# EAGLE design xen_daisy_motherboard_8cv8pt_mki (EAGLE 9.6.0)
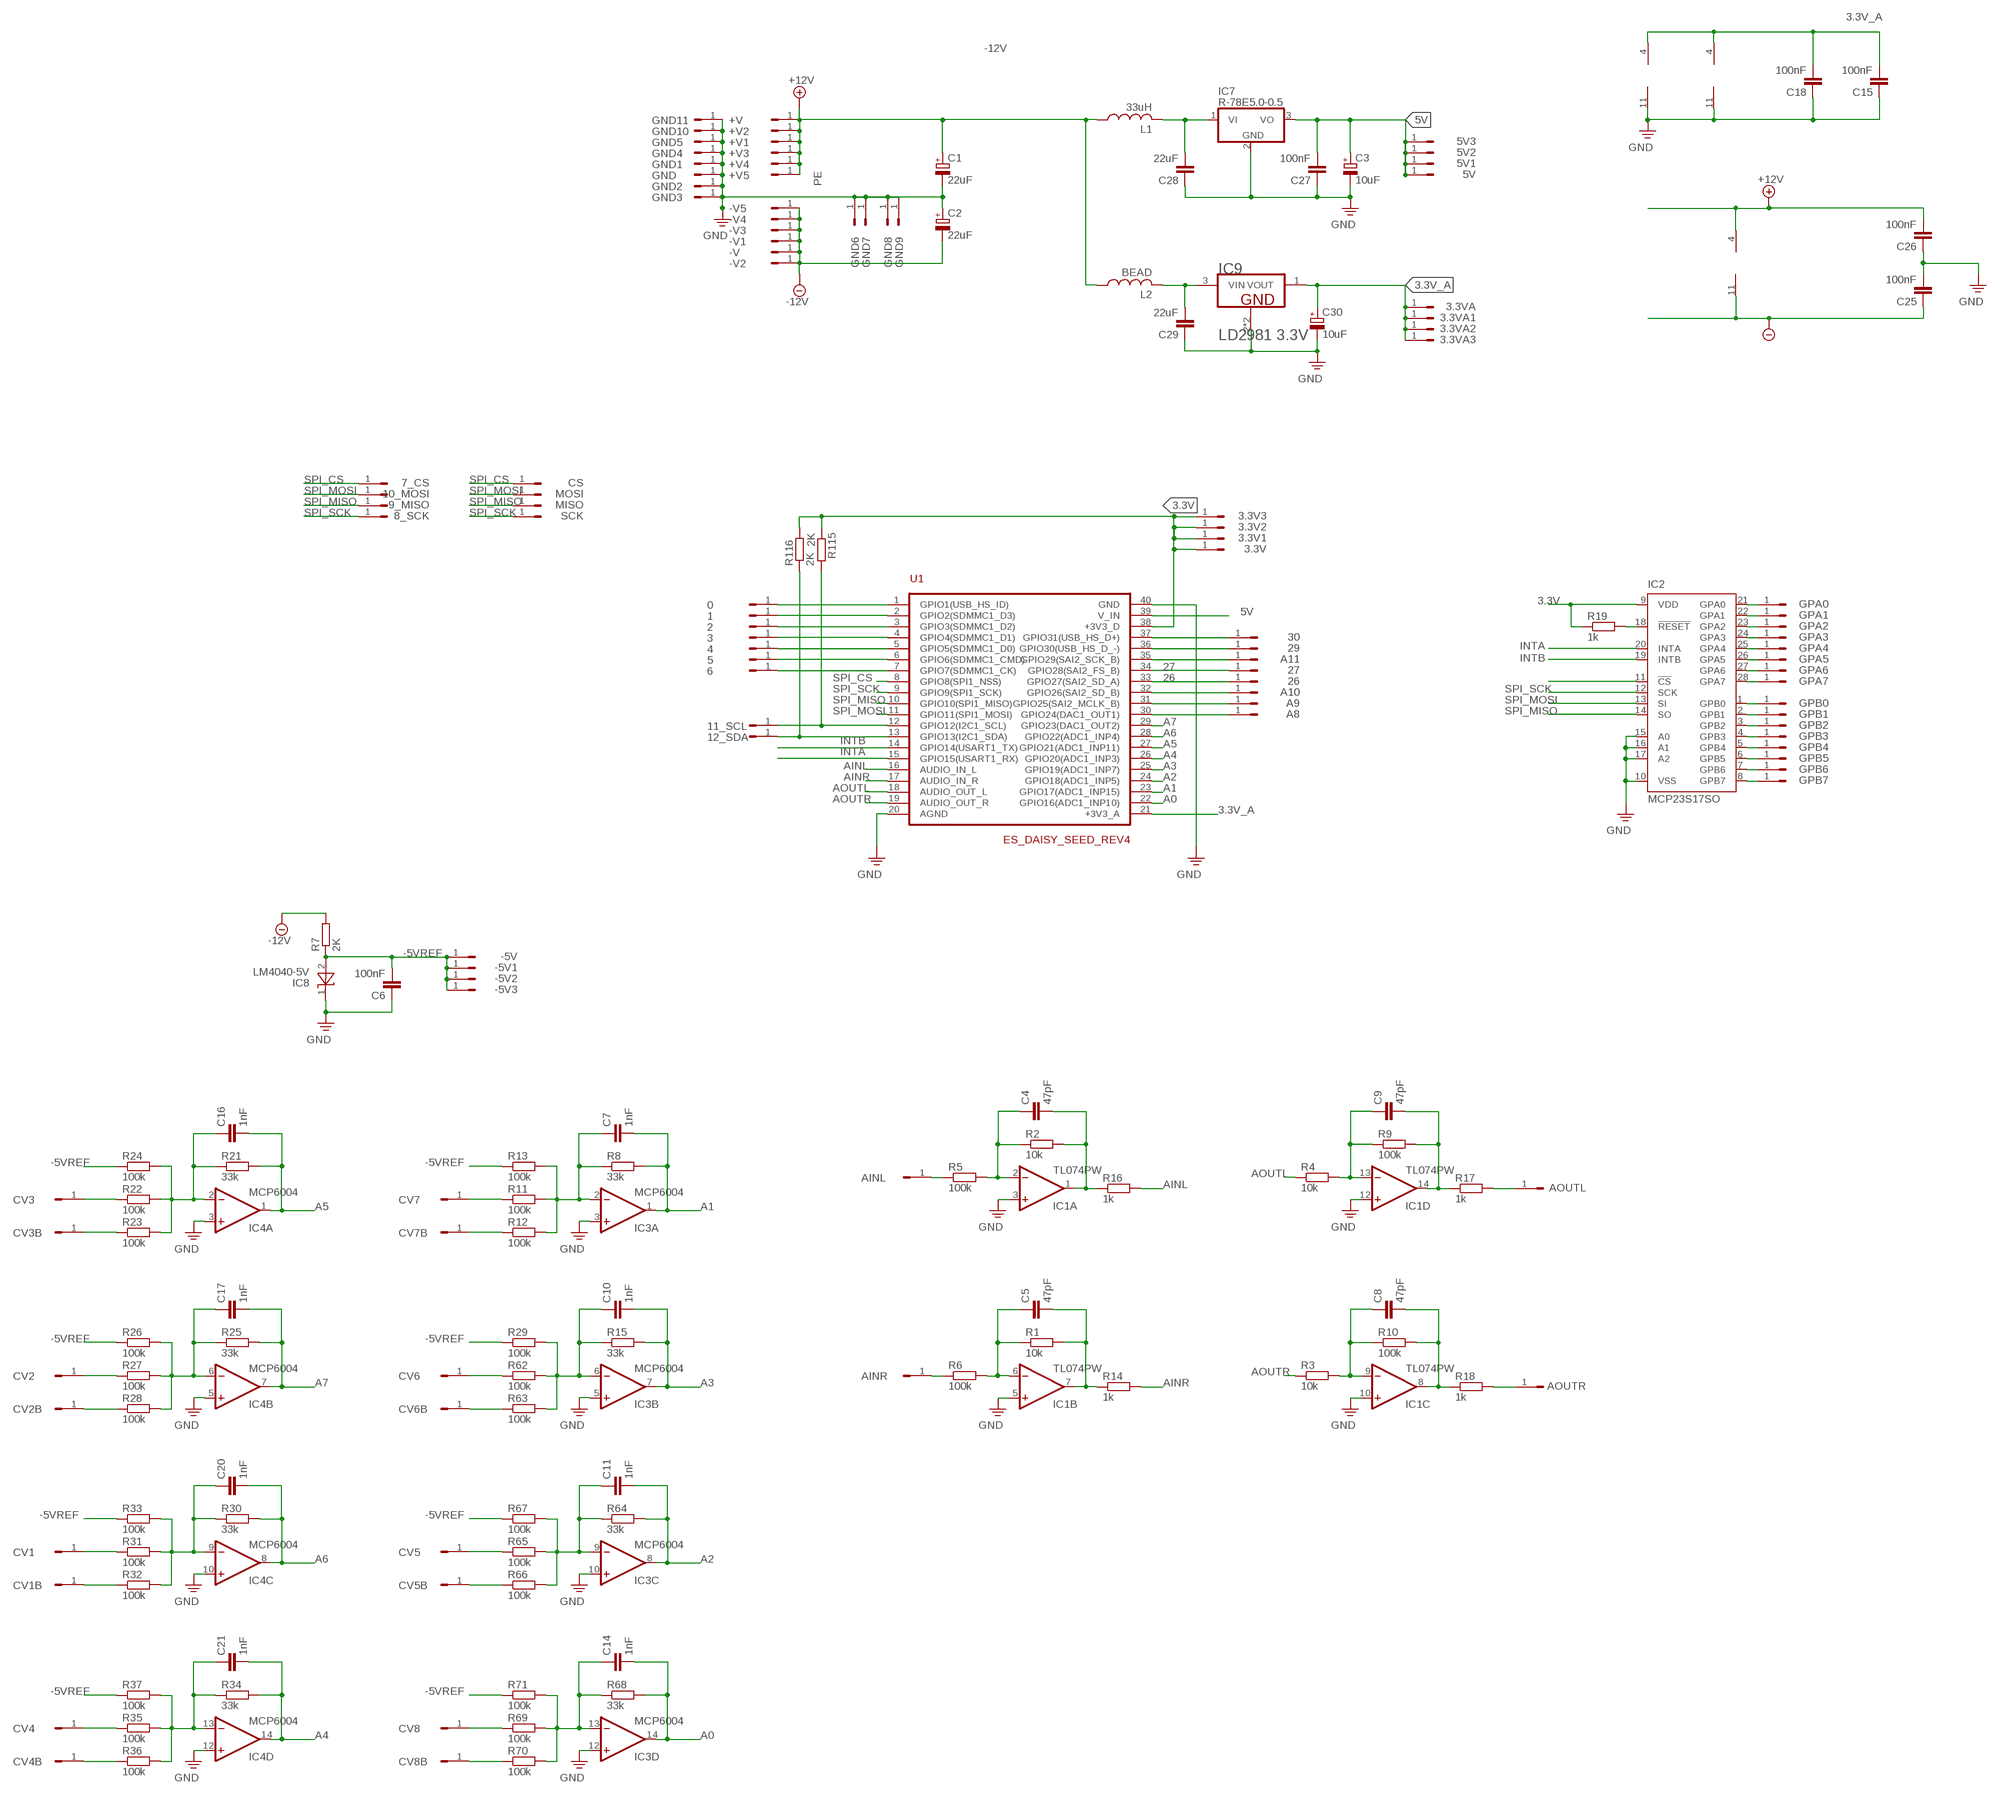
[diagram p0: schematic, sheet 1]

## Parts
0  HEADER/MALE/01  [HEADER/MALE/01]
1  HEADER/MALE/01  [HEADER/MALE/01]
2  HEADER/MALE/01  [HEADER/MALE/01]
3  HEADER/MALE/01  [HEADER/MALE/01]
3.3V  HEADER/MALE/01  [HEADER/MALE/01]
3.3V1  HEADER/MALE/01  [HEADER/MALE/01]
3.3V2  HEADER/MALE/01  [HEADER/MALE/01]
3.3V3  HEADER/MALE/01  [HEADER/MALE/01]
3.3VA  HEADER/MALE/01  [HEADER/MALE/01]
3.3VA1  HEADER/MALE/01  [HEADER/MALE/01]
3.3VA2  HEADER/MALE/01  [HEADER/MALE/01]
3.3VA3  HEADER/MALE/01  [HEADER/MALE/01]
4  HEADER/MALE/01  [HEADER/MALE/01]
5  HEADER/MALE/01  [HEADER/MALE/01]
5V  HEADER/MALE/01  [HEADER/MALE/01]
5V1  HEADER/MALE/01  [HEADER/MALE/01]
5V2  HEADER/MALE/01  [HEADER/MALE/01]
5V3  HEADER/MALE/01  [HEADER/MALE/01]
6  HEADER/MALE/01  [HEADER/MALE/01]
7_CS  HEADER/MALE/01  [HEADER/MALE/01]
8_SCK  HEADER/MALE/01  [HEADER/MALE/01]
9_MISO  HEADER/MALE/01  [HEADER/MALE/01]
10_MOSI  HEADER/MALE/01  [HEADER/MALE/01]
11_SCL  HEADER/MALE/01  [HEADER/MALE/01]
12_SDA  HEADER/MALE/01  [HEADER/MALE/01]
26  HEADER/MALE/01  [HEADER/MALE/01]
27  HEADER/MALE/01  [HEADER/MALE/01]
29  HEADER/MALE/01  [HEADER/MALE/01]
30  HEADER/MALE/01  [HEADER/MALE/01]
+V  HEADER/MALE/01  [HEADER/MALE/01]
+V1  HEADER/MALE/01  [HEADER/MALE/01]
+V2  HEADER/MALE/01  [HEADER/MALE/01]
+V3  HEADER/MALE/01  [HEADER/MALE/01]
+V4  HEADER/MALE/01  [HEADER/MALE/01]
+V5  HEADER/MALE/01  [HEADER/MALE/01]
-5V  HEADER/MALE/01  [HEADER/MALE/01]
-5V1  HEADER/MALE/01  [HEADER/MALE/01]
-5V2  HEADER/MALE/01  [HEADER/MALE/01]
-5V3  HEADER/MALE/01  [HEADER/MALE/01]
-V  HEADER/MALE/01  [HEADER/MALE/01]
-V1  HEADER/MALE/01  [HEADER/MALE/01]
-V2  HEADER/MALE/01  [HEADER/MALE/01]
-V3  HEADER/MALE/01  [HEADER/MALE/01]
-V4  HEADER/MALE/01  [HEADER/MALE/01]
-V5  HEADER/MALE/01  [HEADER/MALE/01]
A8  HEADER/MALE/01  [HEADER/MALE/01]
A9  HEADER/MALE/01  [HEADER/MALE/01]
A10  HEADER/MALE/01  [HEADER/MALE/01]
A11  HEADER/MALE/01  [HEADER/MALE/01]
AINL  HEADER/MALE/01  [HEADER/MALE/01]
AINR  HEADER/MALE/01  [HEADER/MALE/01]
AOUTL  HEADER/MALE/01  [HEADER/MALE/01]
AOUTR  HEADER/MALE/01  [HEADER/MALE/01]
C1  22uF  CAPACITOR/POLARIZEDSMDC  [SV-C]
C2  22uF  CAPACITOR/POLARIZEDSMDC  [SV-C]
C3  10uF  CAPACITOR/POLARIZEDSMDB  [SV-B]
C4  47pF  CAPACITORC0603  [C0603]
C5  47pF  CAPACITORC0603  [C0603]
C6  100nF  CAPACITORC0603  [C0603]
C7  1nF  CAPACITORC0603  [C0603]
C8  47pF  CAPACITORC0603  [C0603]
C9  47pF  CAPACITORC0603  [C0603]
C10  1nF  CAPACITORC0603  [C0603]
C11  1nF  CAPACITORC0603  [C0603]
C14  1nF  CAPACITORC0603  [C0603]
C15  100nF  CAPACITORC0603  [C0603]
C16  1nF  CAPACITORC0603  [C0603]
C17  1nF  CAPACITORC0603  [C0603]
C18  100nF  CAPACITORC0603  [C0603]
C20  1nF  CAPACITORC0603  [C0603]
C21  1nF  CAPACITORC0603  [C0603]
C25  100nF  CAPACITORC0603  [C0603]
C26  100nF  CAPACITORC0603  [C0603]
C27  100nF  CAPACITORC0603  [C0603]
C28  22uF  CAPACITORC0805  [C0805]
C29  22uF  CAPACITORC0805  [C0805]
C30  10uF  CAPACITOR/POLARIZEDSMDB  [SV-B]
CS  HEADER/MALE/01  [HEADER/MALE/01]
CV1  HEADER/MALE/01  [HEADER/MALE/01]
CV1B  HEADER/MALE/01  [HEADER/MALE/01]
CV2  HEADER/MALE/01  [HEADER/MALE/01]
CV2B  HEADER/MALE/01  [HEADER/MALE/01]
CV3  HEADER/MALE/01  [HEADER/MALE/01]
CV3B  HEADER/MALE/01  [HEADER/MALE/01]
CV4  HEADER/MALE/01  [HEADER/MALE/01]
CV4B  HEADER/MALE/01  [HEADER/MALE/01]
CV5  HEADER/MALE/01  [HEADER/MALE/01]
CV5B  HEADER/MALE/01  [HEADER/MALE/01]
CV6  HEADER/MALE/01  [HEADER/MALE/01]
CV6B  HEADER/MALE/01  [HEADER/MALE/01]
CV7  HEADER/MALE/01  [HEADER/MALE/01]
CV7B  HEADER/MALE/01  [HEADER/MALE/01]
CV8  HEADER/MALE/01  [HEADER/MALE/01]
CV8B  HEADER/MALE/01  [HEADER/MALE/01]
GND  HEADER/MALE/01  [HEADER/MALE/01]
GND1  HEADER/MALE/01  [HEADER/MALE/01]
GND2  HEADER/MALE/01  [HEADER/MALE/01]
GND3  HEADER/MALE/01  [HEADER/MALE/01]
GND4  HEADER/MALE/01  [HEADER/MALE/01]
GND5  HEADER/MALE/01  [HEADER/MALE/01]
GND6  HEADER/MALE/01  [HEADER/MALE/01]
GND7  HEADER/MALE/01  [HEADER/MALE/01]
GND8  HEADER/MALE/01  [HEADER/MALE/01]
GND9  HEADER/MALE/01  [HEADER/MALE/01]
GND10  HEADER/MALE/01  [HEADER/MALE/01]
GND11  HEADER/MALE/01  [HEADER/MALE/01]
GPA0  HEADER/MALE/01  [HEADER/MALE/01]
GPA1  HEADER/MALE/01  [HEADER/MALE/01]
GPA2  HEADER/MALE/01  [HEADER/MALE/01]
GPA3  HEADER/MALE/01  [HEADER/MALE/01]
GPA4  HEADER/MALE/01  [HEADER/MALE/01]
GPA5  HEADER/MALE/01  [HEADER/MALE/01]
GPA6  HEADER/MALE/01  [HEADER/MALE/01]
GPA7  HEADER/MALE/01  [HEADER/MALE/01]
GPB0  HEADER/MALE/01  [HEADER/MALE/01]
GPB1  HEADER/MALE/01  [HEADER/MALE/01]
GPB2  HEADER/MALE/01  [HEADER/MALE/01]
GPB3  HEADER/MALE/01  [HEADER/MALE/01]
GPB4  HEADER/MALE/01  [HEADER/MALE/01]
GPB5  HEADER/MALE/01  [HEADER/MALE/01]
GPB6  HEADER/MALE/01  [HEADER/MALE/01]
GPB7  HEADER/MALE/01  [HEADER/MALE/01]
IC1  TL074PW  [TSSOP14]
IC2  MCP23S17SO  [SO28W]
IC3  MCP6004  TL074PW  [TSSOP14]
IC4  MCP6004  TL074PW  [TSSOP14]
IC7  R-78E5.0-0.5  WE173950378  [WE78]
IC8  LM4040-5V  LM4040CYM3-2.5  [SOT-23]
IC9  LD2981 3.3V  LD2981LD2981-SOT89  [LD2981-SOT89]
L1  33uH  INDUCTORL2012C  [L2012C]
L2  BEAD  INDUCTORL0603  [R0603]
MISO  HEADER/MALE/01  [HEADER/MALE/01]
MOSI  HEADER/MALE/01  [HEADER/MALE/01]
R1  10k  RESISTOR  [R0603]
R2  10k  RESISTOR  [R0603]
R3  10k  RESISTOR  [R0603]
R4  10k  RESISTOR  [R0603]
R5  100k  RESISTOR  [R0603]
R6  100k  RESISTOR  [R0603]
R7  2K  RESISTOR  [R0603]
R8  33k  RESISTOR  [R0603]
R9  100k  RESISTOR  [R0603]
R10  100k  RESISTOR  [R0603]
R11  100k  RESISTOR  [R0603]
R12  100k  RESISTOR  [R0603]
R13  100k  RESISTOR  [R0603]
R14  1k  RESISTOR  [R0603]
R15  33k  RESISTOR  [R0603]
R16  1k  RESISTOR  [R0603]
R17  1k  RESISTOR  [R0603]
R18  1k  RESISTOR  [R0603]
R19  1k  RESISTOR  [R0603]
R21  33k  RESISTOR  [R0603]
R22  100k  RESISTOR  [R0603]
R23  100k  RESISTOR  [R0603]
R24  100k  RESISTOR  [R0603]
R25  33k  RESISTOR  [R0603]
R26  100k  RESISTOR  [R0603]
R27  100k  RESISTOR  [R0603]
R28  100k  RESISTOR  [R0603]
R29  100k  RESISTOR  [R0603]
R30  33k  RESISTOR  [R0603]
R31  100k  RESISTOR  [R0603]
R32  100k  RESISTOR  [R0603]
R33  100k  RESISTOR  [R0603]
R34  33k  RESISTOR  [R0603]
R35  100k  RESISTOR  [R0603]
R36  100k  RESISTOR  [R0603]
R37  100k  RESISTOR  [R0603]
R62  100k  RESISTOR  [R0603]
R63  100k  RESISTOR  [R0603]
R64  33k  RESISTOR  [R0603]
R65  100k  RESISTOR  [R0603]
R66  100k  RESISTOR  [R0603]
R67  100k  RESISTOR  [R0603]
R68  33k  RESISTOR  [R0603]
R69  100k  RESISTOR  [R0603]
R70  100k  RESISTOR  [R0603]
R71  100k  RESISTOR  [R0603]
R115  2K  RESISTOR  [R0603]
R116  2K  RESISTOR  [R0603]
SCK  HEADER/MALE/01  [HEADER/MALE/01]
U1  ES_DAISY_SEED_REV4  [ES_DAISY_SEED]

## Nets
3.3V: 3.3V1.1 3.3V2.1 3.3V3.1 3.3V.1 IC2.9(VDD) R19.1 R115.1 R116.2 U1.38(+3V3_D)
3.3V_A: 3.3VA1.1 3.3VA2.1 3.3VA3.1 3.3VA.1 C15.2 C18.2 C30.+ IC3.4(P:V+) IC4.4(P:V+) IC9.1(VOUT) U1.21(+3V3_A)
5V: 5V1.1 5V2.1 5V3.1 5V.1 C3.+ C27.2 IC7.3(VO) U1.39(V_IN)
26: 26.1 U1.33(GPIO27(SAI2_SD_A))
27: 27.1 U1.34(GPIO28(SAI2_FS_B))
+12V: +V1.1 +V2.1 +V3.1 +V4.1 +V5.1 +V.1 C1.+ C26.2 IC1.4(P:V+) L1.1 L2.1
-5VREF: -5V1.1 -5V2.1 -5V3.1 -5V.1 C6.2 IC8.2(A) R7.1 R13.1 R24.1 R26.1 R29.1 R33.1 R37.1 R67.1 R71.1
-12V: -V1.1 -V2.1 -V3.1 -V4.1 -V5.1 -V.1 C2.- C25.1 IC1.11(P:V-) R7.2
A0: C14.2 IC3.14(D:OUT) R68.2 U1.22(GPIO16(ADC1_INP10))
A1: C7.2 IC3.1(A:OUT) R8.2 U1.23(GPIO17(ADC1_INP15))
A2: C11.2 IC3.8(C:OUT) R64.2 U1.24(GPIO18(ADC1_INP5))
A3: C10.2 IC3.7(B:OUT) R15.2 U1.25(GPIO19(ADC1_INP7))
A4: C21.2 IC4.14(D:OUT) R34.2 U1.26(GPIO20(ADC1_INP3))
A5: C16.2 IC4.1(A:OUT) R21.2 U1.27(GPIO21(ADC1_INP11))
A6: C20.2 IC4.8(C:OUT) R30.2 U1.28(GPIO22(ADC1_INP4))
A7: C17.2 IC4.7(B:OUT) R25.2 U1.29(GPIO23(DAC1_OUT2))
AINL: R16.2 U1.16(AUDIO_IN_L)
AINR: R14.2 U1.17(AUDIO_IN_R)
AOUTL: R4.1 U1.18(AUDIO_OUT_L)
AOUTR: R3.1 U1.19(AUDIO_OUT_R)
INTA: IC2.20(INTA) U1.15(GPIO15(USART1_RX))
INTB: IC2.19(INTB) U1.14(GPIO14(USART1_TX))
N$1: CV2.1 R27.1
N$2: A8.1 U1.30(GPIO24(DAC1_OUT1))
N$3: A9.1 U1.31(GPIO25(SAI2_MCLK_B))
N$4: A10.1 U1.32(GPIO26(SAI2_SD_B))
N$5: A11.1 U1.35(GPIO29(SAI2_SCK_B))
N$6: C5.1 IC1.6(B:-IN) R1.1 R6.2
N$7: C4.1 IC1.2(A:-IN) R2.1 R5.2
N$8: C7.1 IC3.2(A:-IN) R8.1 R11.2 R12.2 R13.2
N$9: C4.2 IC1.1(A:OUT) R2.2 R16.1
N$10: C5.2 IC1.7(B:OUT) R1.2 R14.1
N$11: AOUTL.1 R17.2
N$12: AOUTR.1 R18.2
N$13: CV7B.1 R12.1
N$14: CV7.1 R11.1
N$15: C9.1 IC1.13(D:-IN) R4.2 R9.1
N$16: C10.1 IC3.6(B:-IN) R15.1 R29.2 R62.2 R63.2
N$17: C8.1 IC1.9(C:-IN) R3.2 R10.1
N$18: CV6.1 R62.1
N$19: CV6B.1 R63.1
N$20: AINL.1 R5.1
N$21: C8.2 IC1.8(C:OUT) R10.2 R18.1
N$22: CV3.1 R22.1
N$23: C9.2 IC1.14(D:OUT) R9.2 R17.1
N$24: C16.1 IC4.2(A:-IN) R21.1 R22.2 R23.2 R24.2
N$25: AINR.1 R6.1
N$26: CV2B.1 R28.1
N$27: CV3B.1 R23.1
N$28: 29.1 U1.36(GPIO30(USB_HS_D_-))
N$29: C17.1 IC4.6(B:-IN) R25.1 R26.2 R27.2 R28.2
N$30: C21.1 IC4.13(D:-IN) R34.1 R35.2 R36.2 R37.2
N$31: CV4.1 R35.1
N$32: CV4B.1 R36.1
N$33: 30.1 U1.37(GPIO31(USB_HS_D+))
N$34: CV1B.1 R32.1
N$35: CV1.1 R31.1
N$36: C20.1 IC4.9(C:-IN) R30.1 R31.2 R32.2 R33.2
N$37: 0.1 U1.1(GPIO1(USB_HS_ID))
N$38: 1.1 U1.2(GPIO2(SDMMC1_D3))
N$39: 2.1 U1.3(GPIO3(SDMMC1_D2))
N$40: 3.1 U1.4(GPIO4(SDMMC1_D1))
N$41: 11_SCL.1 R115.2 U1.12(GPIO12(I2C1_SCL))
N$42: 4.1 U1.5(GPIO5(SDMMC1_D0))
N$43: 5.1 U1.6(GPIO6(SDMMC1_CMD))
N$44: 6.1 U1.7(GPIO7(SDMMC1_CK))
N$48: IC2.18(!RESET) R19.2
N$50: IC2.11(!CS)
N$51: C28.2 IC7.1(VI) L1.2
N$52: 12_SDA.1 R116.1 U1.13(GPIO13(I2C1_SDA))
N$54: GPB7.1 IC2.8(GPB7)
N$55: GPB6.1 IC2.7(GPB6)
N$56: GPB5.1 IC2.6(GPB5)
N$57: C14.1 IC3.13(D:-IN) R68.1 R69.2 R70.2 R71.2
N$58: GPB4.1 IC2.5(GPB4)
N$59: GPB3.1 IC2.4(GPB3)
N$60: CV8.1 R69.1
N$61: GPB2.1 IC2.3(GPB2)
N$62: GPB1.1 IC2.2(GPB1)
N$63: GPB0.1 IC2.1(GPB0)
N$64: GPA7.1 IC2.28(GPA7)
N$65: GPA6.1 IC2.27(GPA6)
N$66: GPA5.1 IC2.26(GPA5)
N$67: GPA4.1 IC2.25(GPA4)
N$68: CV8B.1 R70.1
N$69: CV5B.1 R66.1
N$70: CV5.1 R65.1
N$71: C11.1 IC3.9(C:-IN) R64.1 R65.2 R66.2 R67.2
N$72: C29.2 IC9.3(VIN) L2.2
N$73: GPA3.1 IC2.24(GPA3)
N$74: GPA2.1 IC2.23(GPA2)
N$75: GPA1.1 IC2.22(GPA1)
N$76: GPA0.1 IC2.21(GPA0)
PE: C1.- C2.+ C3.- C6.1 C15.1 C18.1 C25.2 C26.1 C27.1 C28.1 C29.1 C30.- GND1.1 GND2.1 GND3.1 GND4.1 GND5.1 GND6.1 GND7.1 GND8.1 GND9.1 GND10.1 GND11.1 GND.1 IC1.3(A:+IN) IC1.5(B:+IN) IC1.10(C:+IN) IC1.12(D:+IN) IC2.10(VSS) IC2.15(A0) IC2.16(A1) IC2.17(A2) IC3.3(A:+IN) IC3.5(B:+IN) IC3.10(C:+IN) IC3.11(P:V-) IC3.12(D:+IN) IC4.3(A:+IN) IC4.5(B:+IN) IC4.10(C:+IN) IC4.11(P:V-) IC4.12(D:+IN) IC7.2(GND) IC8.1(C) IC9.2(GND) IC9.2-2(GND) U1.20(AGND) U1.40(GND) ; supply symbol labelled GND
SPI_CS: 7_CS.1 CS.1 U1.8(GPIO8(SPI1_NSS))
SPI_MISO: 9_MISO.1 IC2.14(SO) MISO.1 U1.10(GPIO10(SPI1_MISO))
SPI_MOSI: 10_MOSI.1 IC2.13(SI) MOSI.1 U1.11(GPIO11(SPI1_MOSI))
SPI_SCK: 8_SCK.1 IC2.12(SCK) SCK.1 U1.9(GPIO9(SPI1_SCK))

## Library data of the parts
0 1-3 3.3V 3.3V1-3.3V3 3.3VA 3.3VA1-3.3VA3 4 5 5V 5V1-5V3 6 7_CS 8_SCK 9_MISO 10_MOSI 11_SCL 12_SDA 26 27 29 30 +V +V1-+V5 -5V -5V1--5V3 -V -V1--V5 A8-A11 AINL AINR AOUTL AOUTR CS CV1 CV1B CV2 CV2B CV3 CV3B CV4 CV4B CV5 CV5B CV6 CV6B CV7 CV7B CV8 CV8B GND GND1-GND11 GPA0 GPA1-GPA7 GPB0 GPB1-GPB7 MISO MOSI SCK = connectors:HEADER/MALE/01; SPICEPREFIX: X
C1-C3 C30 = capacitors:CAPACITOR/POLARIZED: POLARIZED CAPACITOR, European symbol; SPICEPREFIX: C
C4-C11 C14 C16 C17 C20 C21 C27-C29 = capacitors:CAPACITOR: CAPACITOR, European symbol
C15 C18 C25 C26 = capacitors:CAPACITOR: CAPACITOR, European symbol; SPICEPREFIX: C
IC1 IC3 IC4 = ic_analogue:TL074: OP AMP; SPICEPREFIX: I
IC2 = ic_digital:MCP23S17: http://ww1.microchip.com/downloads/en/DeviceDoc/21952a.pdf Source: http://ww1.microchip.com/downloads/en/DeviceDoc/21952a.pdf; MF: MICROCHIP; MPN: MCP23S17-E/SO; OC_FARNELL: unknown; OC_NEWARK: 31K2950
IC7 = ic_voltage_reg:WE173950378
IC8 = ic_voltage_reg:LM4040
IC9 = ic_voltage_reg:LD2981: PM-REG-7805-SIL3; CIIVA_IDS: 1494330; COMPONENT_LINK_1_DESCRIPTION: Manufacturer URL; COMPONENT_LINK_1_URL: http://www.st.com; DATASHEET: http://www.st.com/internet/com/TECHNICAL_RESOURCES/TECHNICAL_LITERATURE/DATASHEET/CD00001635.pdf; DATASHEET_VERSION: 14/07/2008; FOOTPRINT_VARIANT_NAME_0: Level C; FOOTPRINT_VARIANT_NAME_1: Level B; FOOTPRINT_VARIANT_NAME_2: Level A; IMPORTED: yes; IMPORTED_FROM: vault; IMPORT_TS: 1521842653; MF: STMicroelectronics; MPN: LD2981CU33TR; PACKAGE: SOT-89; PACKAGE_DESCRIPTION: 3-Pin SOT-89 Package 1.5 mm Pitch, 4.1 mm Lead Span; PACKAGE_VERSION: 2011; PREFIX: U; RELEASE_DATE: 1329864115; VAULT_GUID: D31A5547-DC71-496C-B469-D3C4896B0EF1; VAULT_REVISION: 2FAEF0D7-B25B-4AA3-8C5F-6F8AF18FFD96
L1 L2 = resistors:INDUCTOR
R1-R19 R21-R37 R62-R71 R115 R116 = resistors:RESISTOR: RESISTOR, European symbol
U1 = microcontroller:ES_DAISY_SEED_REV4; IPN: Daisy Seed

## Board
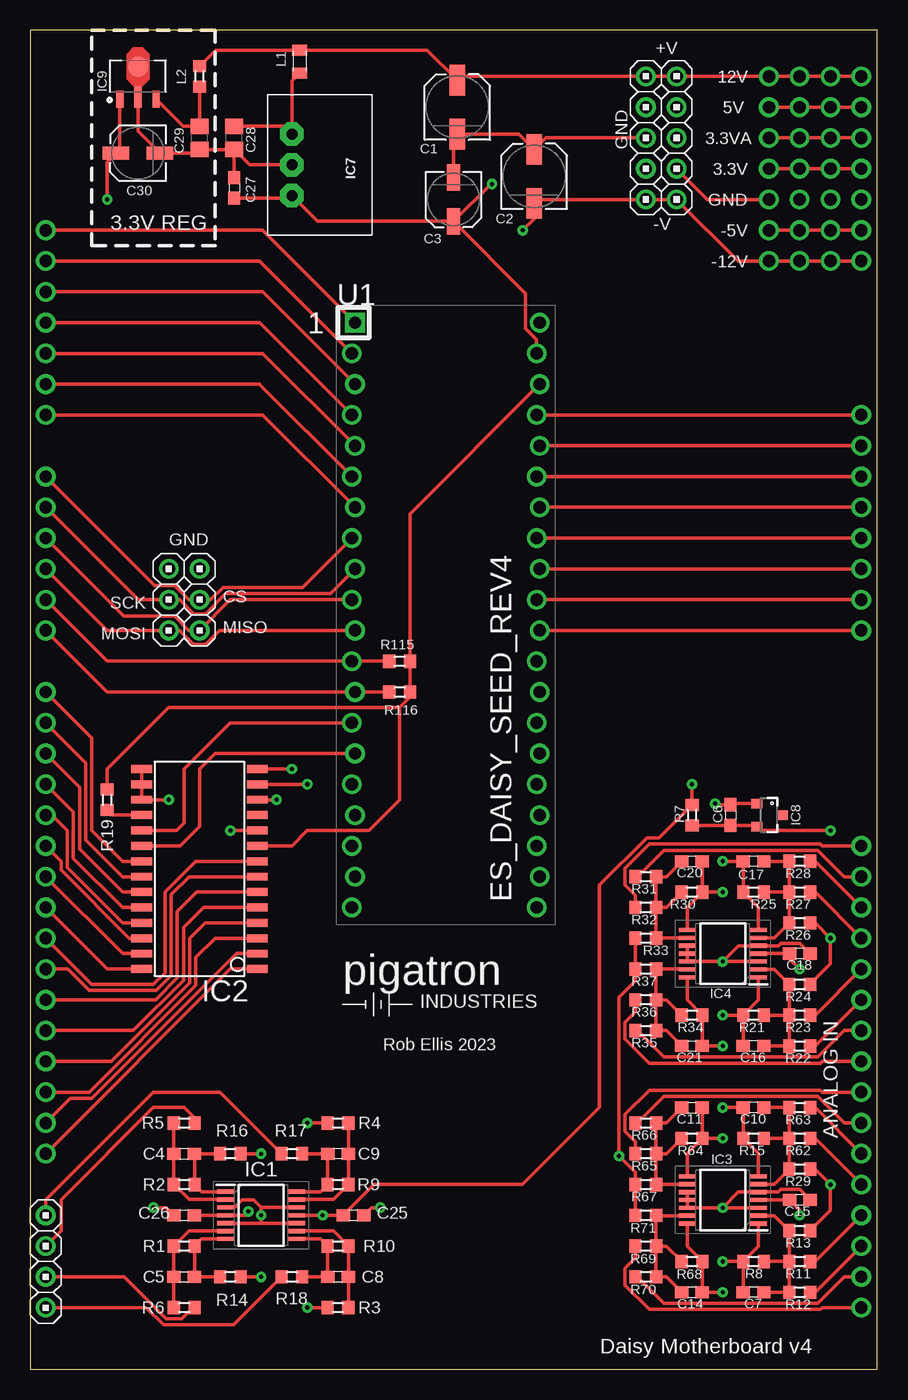
[diagram p1: board, top side]
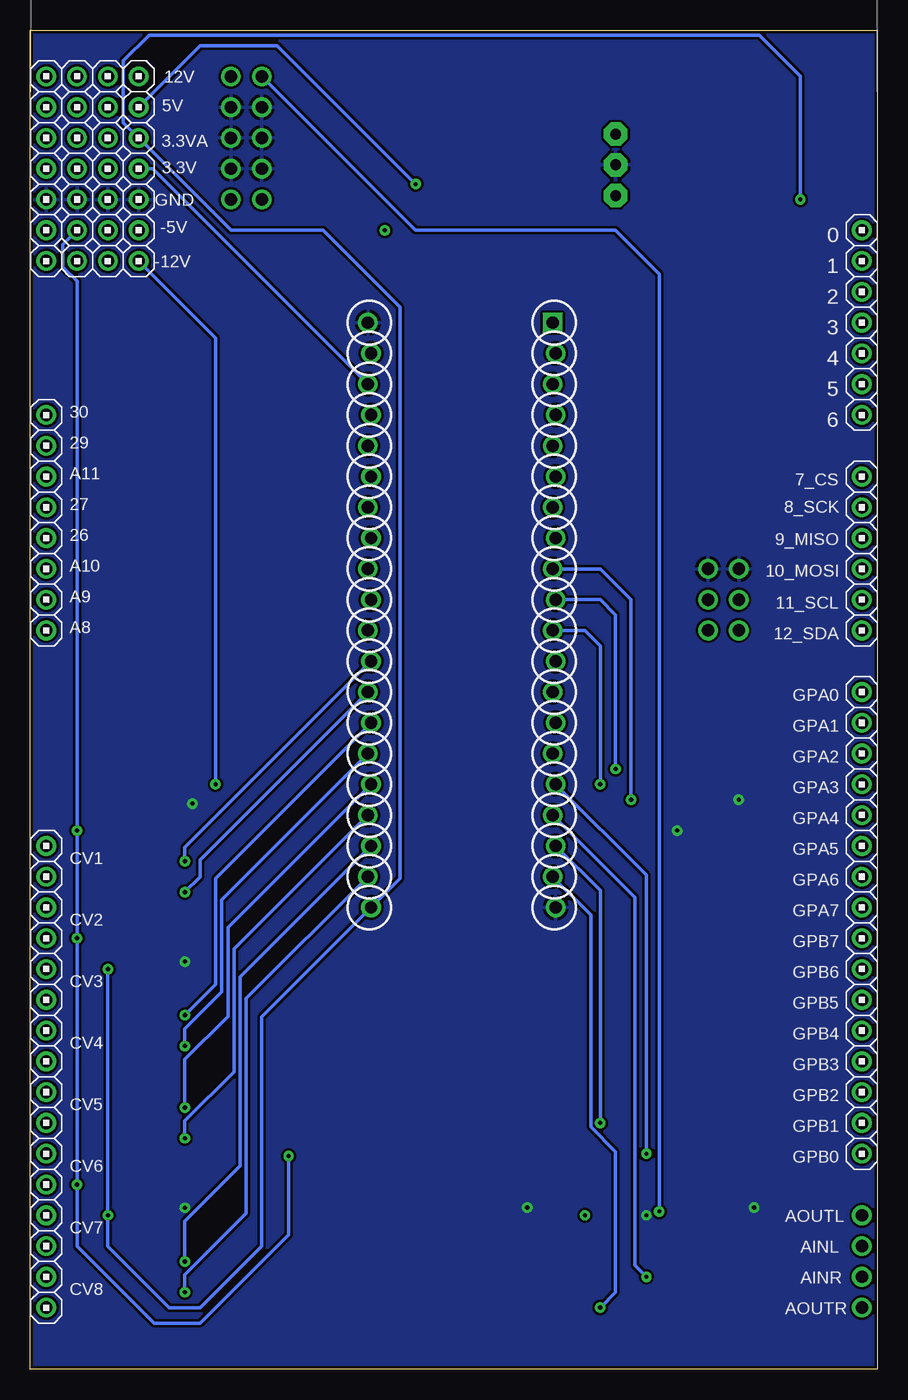
[diagram p2: board, bottom side, seen from below]

Size 69.9 x 110.48 mm. Coordinates in mm from the lower left corner, seen from the top.
Outline: 0,0 69.9,0 69.9,110.48 0,110.48 0,0
Copper layers (1*16): Top 0.0356mm / dielectric 1.5011mm / Bottom 0.0356mm
Design rules "pigatron *": minimum track width 8mil, minimum drill 13mil, track to track 8mil, track to pad 8mil, pad to pad 8mil, via to via 8mil, smd to smd 6mil, copper to edge 10mil, drill to drill 10mil, minimum pad ring 12mil, minimum via ring 10mil, stop-mask expansion 4mil, vias tented up to drill 15mil, thermal gap 10mil

### Footprints (pad centres in the part's own frame; a part is rotated, then mirrored left to right if it is on the bottom)
HEADER/MALE/01 = drill 1.016: 1 0,0
SV-C = smd 2.54 x 1.27: + -2.223,0; - 2.223,0
SV-B = smd 2.184 x 1.067: + -1.81,0; - 1.81,0
C0603 = smd 1.1 x 1: 1 -0.85,0; 2 0.85,0
C0805 = smd 1.3 x 1.5: 1 -0.95,0; 2 0.95,0
TSSOP14 = smd 0.35 x 1.4: 1 -1.95,-2.938; 2 -1.3,-2.938; 3 -0.65,-2.938; 4 0,-2.938; 5 0.65,-2.938; 6 1.3,-2.938; 7 1.95,-2.938; 8 1.95,2.938; 9 1.3,2.938; 10 0.65,2.938; 11 0,2.938; 12 -0.65,2.938; 13 -1.3,2.938; 14 -1.95,2.938
SO28W = smd 0.65 x 1.7: 1 -7.62,-4.78; 2 -6.35,-4.78; 3 -5.08,-4.78; 4 -3.81,-4.78; 5 -2.54,-4.78; 6 -1.27,-4.78; 7 0,-4.78; 8 1.27,-4.78; 9 2.54,-4.78; 10 3.81,-4.78; 11 5.08,-4.78; 12 6.35,-4.78; 13 7.62,-4.78; 14 8.89,-4.78; 15 8.89,4.78; 16 7.62,4.78; 17 6.35,4.78; 18 5.08,4.78; 19 3.81,4.78; 20 2.54,4.78; 21 1.27,4.78; 22 0,4.78; 23 -1.27,4.78; 24 -2.54,4.78; 25 -3.81,4.78; 26 -5.08,4.78; 27 -6.35,4.78; 28 -7.62,4.78
WE78 = drill 0.9 pad 1.93 octagon: 1 -2.54,0; 2 0,0; 3 2.54,0
SOT-23 = smd 0.8 x 0.9: 1 -0.95,-1; 2 0.95,-1; 3 0,1.1
LD2981-SOT89 = smd 1.4 x 0.6: 1 -1.9,1.5; 3 -1.9,-1.5 | smd 1.8 x 0.6: 2 -1.7,0 | smd 1.71 x 1.71: 2-2 0.8,0
L2012C = smd 0.9 x 1.25: 1 -0.9,0; 2 1,0
R0603 = smd 1 x 1.1: 1 -0.85,0; 2 0.85,0
ES_DAISY_SEED = drill 1.016 square: 1 -7.493,24.13 | drill 1.016: 2 -7.747,21.59; 3 -7.493,19.05; 4 -7.747,16.51; 5 -7.493,13.97; 6 -7.747,11.43; 7 -7.493,8.89; 8 -7.747,6.35; 9 -7.493,3.81; 10 -7.747,1.27; 11 -7.493,-1.27; 12 -7.747,-3.81; 13 -7.493,-6.35; 14 -7.747,-8.89; 15 -7.493,-11.43; 16 -7.747,-13.97; 17 -7.493,-16.51; 18 -7.747,-19.05; 19 -7.493,-21.59; 20 -7.747,-24.13; 21 7.493,-24.13; 22 7.747,-21.59; 23 7.493,-19.05; 24 7.747,-16.51; 25 7.493,-13.97; 26 7.747,-11.43; 27 7.493,-8.89; 28 7.747,-6.35; 29 7.493,-3.81; 30 7.747,-1.27; 31 7.493,1.27; 32 7.747,3.81; 33 7.493,6.35; 34 7.747,8.89; 35 7.493,11.43; 36 7.747,13.97; 37 7.493,16.51; 38 7.747,19.05; 39 7.493,21.59; 40 7.747,24.13

### Placement (x,y rotation side)
0  1.27,93.98 180 bottom
1  1.27,91.44 180 bottom
2  1.27,88.9 180 bottom
3  1.27,86.36 180 bottom
3.3V  60.96,99.06 90 bottom
3.3V1  63.5,99.06 180 bottom
3.3V2  66.04,99.06 0 bottom
3.3V3  68.58,99.06 0 bottom
3.3VA  60.96,101.6 180 bottom
3.3VA1  63.5,101.6 0 bottom
3.3VA2  66.04,101.6 0 bottom
3.3VA3  68.58,101.6 0 bottom
4  1.27,83.82 180 bottom
5  1.27,81.28 180 bottom
5V  60.96,104.14 180 bottom
5V1  63.5,104.14 180 bottom
5V2  66.04,104.14 0 bottom
5V3  68.58,104.14 0 bottom
6  1.27,78.74 180 bottom
7_CS  1.27,73.66 180 bottom
8_SCK  1.27,71.12 180 bottom
9_MISO  1.27,68.58 180 bottom
10_MOSI  1.27,66.04 180 bottom
11_SCL  1.27,63.5 180 bottom
12_SDA  1.27,60.96 180 bottom
26  68.58,68.58 0 bottom
27  68.58,71.12 0 bottom
29  68.58,76.2 0 bottom
30  68.58,78.74 0 bottom
+V  53.34,106.68 0 top
+V1  63.5,106.68 0 bottom
+V2  50.8,106.68 180 top
+V3  60.96,106.68 0 bottom
+V4  66.04,106.68 0 bottom
+V5  68.58,106.68 0 bottom
-5V  63.5,93.98 180 bottom
-5V1  60.96,93.98 180 bottom
-5V2  66.04,93.98 0 bottom
-5V3  68.58,93.98 0 bottom
-V  53.34,96.52 0 top
-V1  60.96,91.44 0 bottom
-V2  50.8,96.52 180 top
-V3  63.5,91.44 0 bottom
-V4  66.04,91.44 0 bottom
-V5  68.58,91.44 0 bottom
A8  68.58,60.96 0 bottom
A9  68.58,63.5 0 bottom
A10  68.58,66.04 0 bottom
A11  68.58,73.66 0 bottom
AINL  1.27,10.16 0 top
AINR  1.27,7.62 0 top
AOUTL  1.27,12.7 0 top
AOUTR  1.27,5.08 0 top
C1  35.24,104.14 270 top
C2  41.59,98.42 270 top
C3  34.92,96.52 90 top
C4  12.7,17.78 0 top
C5  12.7,7.62 0 top
C6  57.78,45.72 270 top
C7  59.69,6.35 180 top
C8  25.4,7.62 180 top
C9  25.4,17.78 180 top
C10  59.69,21.59 180 top
C11  54.61,21.59 0 top
C14  54.61,6.35 0 top
C15  63.5,13.97 180 top
C16  59.69,26.67 180 top
C17  59.69,41.91 180 top
C18  63.5,34.29 180 top
C20  54.61,41.91 0 top
C21  54.61,26.67 0 top
C25  26.67,12.7 0 top
C26  12.7,12.7 0 top
C27  16.83,97.47 270 top
C28  16.83,101.6 90 top
C29  13.97,101.6 90 top
C30  8.89,100.33 0 top
CS  13.97,63.5 0 top
CV1  68.58,40.64 180 bottom
CV1B  68.58,43.18 180 bottom
CV2  68.58,35.56 180 bottom
CV2B  68.58,38.1 180 bottom
CV3  68.58,30.48 180 bottom
CV3B  68.58,33.02 180 bottom
CV4  68.58,27.94 180 bottom
CV4B  68.58,25.4 180 bottom
CV5  68.58,22.86 0 bottom
CV5B  68.58,20.32 0 bottom
CV6  68.58,15.24 0 bottom
CV6B  68.58,17.78 0 bottom
CV7  68.58,12.7 0 bottom
CV7B  68.58,10.16 0 bottom
CV8  68.58,5.08 0 bottom
CV8B  68.58,7.62 0 bottom
GND  53.34,101.6 0 top
GND1  53.34,104.14 0 top
GND2  50.8,99.06 180 top
GND3  53.34,99.06 180 top
GND4  50.8,101.6 0 top
GND5  50.8,104.14 0 top
GND6  63.5,96.52 0 bottom
GND7  60.96,96.52 0 bottom
GND8  66.04,96.52 0 bottom
GND9  68.58,96.52 0 bottom
GND10  13.97,66.04 0 top
GND11  11.43,66.04 0 top
GPA0  1.27,55.88 180 bottom
GPA1  1.27,53.34 180 bottom
GPA2  1.27,50.8 180 bottom
GPA3  1.27,48.26 180 bottom
GPA4  1.27,45.72 180 bottom
GPA5  1.27,43.18 180 bottom
GPA6  1.27,40.64 180 bottom
GPA7  1.27,38.1 180 bottom
GPB0  1.27,17.78 180 bottom
GPB1  1.27,20.32 180 bottom
GPB2  1.27,22.86 180 bottom
GPB3  1.27,25.4 180 bottom
GPB4  1.27,27.94 180 bottom
GPB5  1.27,30.48 180 bottom
GPB6  1.27,33.02 180 bottom
GPB7  1.27,35.56 180 bottom
IC1  19.05,12.7 270 top
IC2  13.97,40.64 90 top
IC3  57.15,13.97 90 top
IC4  57.15,34.29 90 top
IC7  21.59,99.38 270 top
IC8  60.96,45.72 270 top
IC9  8.89,106.68 90 top
L1  22.23,107.95 270 top
L2  13.97,106.68 270 top
MISO  13.97,60.96 0 top
MOSI  11.43,60.96 180 top
R1  12.7,10.16 0 top
R2  12.7,15.24 0 top
R3  25.4,5.08 0 top
R4  25.4,20.32 0 top
R5  12.7,20.32 180 top
R6  12.7,5.08 180 top
R7  54.61,45.72 90 top
R8  59.69,8.89 180 top
R9  25.4,15.24 180 top
R10  25.4,10.16 180 top
R11  63.5,8.89 180 top
R12  63.5,6.35 180 top
R13  63.5,11.43 180 top
R14  16.51,7.62 0 top
R15  59.69,19.05 180 top
R16  16.51,17.78 0 top
R17  21.59,17.78 180 top
R18  21.59,7.62 180 top
R19  6.35,46.99 270 top
R21  59.69,29.21 180 top
R22  63.5,26.67 180 top
R23  63.5,29.21 180 top
R24  63.5,31.75 180 top
R25  59.69,39.37 180 top
R26  63.5,36.83 180 top
R27  63.5,39.37 180 top
R28  63.5,41.91 180 top
R29  63.5,16.51 180 top
R30  54.61,39.37 0 top
R31  50.8,40.64 0 top
R32  50.8,38.1 0 top
R33  50.8,35.56 0 top
R34  54.61,29.21 0 top
R35  50.8,27.94 0 top
R36  50.8,30.48 0 top
R37  50.8,33.02 0 top
R62  63.5,19.05 180 top
R63  63.5,21.59 180 top
R64  54.61,19.05 0 top
R65  50.8,17.78 0 top
R66  50.8,20.32 0 top
R67  50.8,15.24 0 top
R68  54.61,8.89 0 top
R69  50.8,10.16 0 top
R70  50.8,7.62 0 top
R71  50.8,12.7 0 top
R115  30.48,58.42 180 top
R116  30.48,55.88 0 top
SCK  11.43,63.5 180 top
U1  34.29,62.23 0 top
U$1  [PIGATRON-LOGO]  34.67,31.69 0 top

### Tracks (layer width: path | path; a pad name or v marks a point on that pad's centre or on a via)
3.3V
  Top 0.305: 3.3V.1 3.3V1.1 3.3V2.1 3.3V3.1 | U1.38 31.33,70.57 R115.1 R116.2 31.33,55.46 30.48,54.61 | R19.1 6.35,49.53 11.43,54.61 30.48,54.61 | IC2.9 21.59,43.18 22.86,44.45 27.94,44.45 30.48,46.99 30.48,54.61
  Bottom 0.305: U1.38 59.82,99.06 3.3V.1
3.3V_A  (via drill 0.35)
  Top 0.305: IC9.1 7.39,100.64 C30.+ 6.35,99.6 v6.35,96.52 | IC4.4 C18.2 62.65,33.87 v63.5,33.02 | IC3.4 C15.2 63.5,13.12 v63.5,12.7 | 3.3VA.1 3.3VA1.1 3.3VA2.1 3.3VA3.1
  Bottom 0.305: v6.35,96.52 6.35,106.68 9.74,110.07 60.11,110.07 62.23,107.95 62.23,102.87 3.3VA.1 53.34,93.98 45.72,93.98 39.37,87.63 39.37,40.51 U1.21 50.8,29.08 50.8,10.16 55.88,5.08 58.42,5.08 63.5,10.16 v63.5,12.7 v63.5,33.02
5V  (via drill 0.35)
  Top 0.305: C27.2 21.38,96.62 IC7.3 23.72,94.71 C3.+ | 5V3.1 5V2.1 5V1.1 5V.1 | C3.+ 38.01,97.79 v38.1,97.79 | U1.39 41.78,84.96 40.87,85.88 40.87,88.77 C3.+
  Bottom 0.305: v38.1,97.79 49.53,109.22 55.88,109.22 5V.1
26
  Top 0.305: U1.33 26.1
27
  Top 0.305: 27.1 U1.34
+12V  (via drill 0.35)
  Top 0.305: +V5.1 +V4.1 +V1.1 +V3.1 +V.1 +V2.1 35.56,106.68 C1.+ 32.76,108.85 L1.1 15.29,108.85 L2.1 | C26.2 IC1.4 17.78,12.7 17.99,12.91 v17.99,13.02
  Bottom 0.305: +V2.1 38.1,93.98 21.59,93.98 17.99,90.38 v17.99,13.02
-5VREF  (via drill 0.35)
  Top 0.305: R33.1 R37.1 49.95,32.03 48.59,30.67 v48.59,17.59 49.95,16.23 R67.1 R71.1 | R7.1 C6.2 59.86,44.87 IC8.2 60.28,44.45 v66.04,44.45 | -5V3.1 -5V2.1 -5V.1 -5V1.1 | R24.1 66.04,33.44 v66.04,35.56 64.77,36.83 R26.1 | R29.1 64.77,16.51 v66.04,15.24 66.04,13.12 R13.1
  Bottom 0.305: -5V2.1 67.21,92.81 67.21,90.96 66.04,89.79 v66.04,44.45 v66.04,35.56 v66.04,15.24 66.04,10.16 59.69,3.81 55.88,3.81 48.59,11.1 v48.59,17.59
-12V  (via drill 0.35)
  Top 0.305: -V5.1 -V4.1 -V3.1 -V1.1 58.42,91.44 -V.1 -V2.1 41.91,96.52 C2.- 41.59,94.93 v40.64,93.98 | IC1.11 v24.13,12.7 C25.1 28.36,15.24 40.64,15.24 46.99,21.59 46.99,39.95 50.87,43.83 51.87,43.83 R7.2 v54.61,48.26
  Bottom 0.305: v54.61,48.26 54.61,85.09 -V1.1
A0  (via drill 0.35)
  Top 0.305: IC3.14 54.21,10.14 R68.2 C14.2 v57.15,6.35
  Bottom 0.305: U1.22 52.07,30.61 52.07,12.86 57.15,7.78 v57.15,6.35
A1  (via drill 0.35)
  Top 0.305: R8.2 60.09,10.14 IC3.1 | C7.2 R8.2 | R8.2 v57.15,8.89
  Bottom 0.305: U1.23 52.58,32.38 52.58,16.78 57.15,12.21 v57.15,8.89
A2  (via drill 0.35)
  Top 0.305: C11.2 R64.2 | R64.2 54.21,17.8 IC3.8 | R64.2 v57.15,19.05
  Bottom 0.305: U1.24 53.09,34.67 53.09,24.54 57.15,20.48 v57.15,19.05
A3  (via drill 0.35)
  Top 0.305: IC3.7 60.09,17.8 R15.2 C10.2 v57.15,21.59
  Bottom 0.305: U1.25 53.59,36.45 53.59,29.12 57.15,25.56 v57.15,21.59
A4  (via drill 0.35)
  Top 0.305: IC4.14 54.21,30.46 R34.2 C21.2 v57.15,26.67
  Bottom 0.305: U1.26 54.1,38.73 54.1,31.15 57.15,28.1 v57.15,26.67
A5  (via drill 0.35)
  Top 0.305: C16.2 R21.2 | R21.2 60.09,30.46 IC4.1 | R21.2 v57.15,29.21
  Bottom 0.305: U1.27 54.61,40.51 54.61,31.75 v57.15,29.21
A6  (via drill 0.35)
  Top 0.305: R30.2 54.21,38.12 IC4.8 | C20.2 R30.2 | R30.2 v57.15,39.37
  Bottom 0.305: U1.28 55.88,42.04 55.88,40.64 v57.15,39.37
A7  (via drill 0.35)
  Top 0.305: IC4.7 60.09,38.12 R25.2 C17.2 v57.15,41.91
  Bottom 0.305: U1.29 57.15,43.05 v57.15,41.91
AINL  (via drill 0.35)
  Top 0.305: v19.05,17.78 R16.2
  Bottom 0.305: U1.16 19.05,40.77 v19.05,17.78
AINR  (via drill 0.35)
  Top 0.305: v19.05,7.62 R14.2
  Bottom 0.305: U1.17 20,38.92 20,8.57 v19.05,7.62
AOUTL  (via drill 0.35)
  Top 0.305: v22.86,20.32 R4.1
  Bottom 0.305: U1.18 22.86,39.5 v22.86,20.32
AOUTR  (via drill 0.35)
  Top 0.305: R3.1 v22.86,5.08
  Bottom 0.305: v22.86,5.08 21.59,6.35 21.59,17.94 23.64,20 23.64,37.49 U1.19
INTA
  Top 0.305: U1.15 15.24,50.8 13.97,49.53 13.97,44.77 12.38,43.18 IC2.20
INTB
  Top 0.305: IC2.19 12.06,44.45 12.7,45.09 12.7,49.53 16.51,53.34 U1.14
N$1
  Top 0.305: CV2.1 64.77,39.37 R27.1
N$2
  Top 0.305: A8.1 U1.30
N$3
  Top 0.305: U1.31 A9.1
N$4
  Top 0.305: A10.1 U1.32
N$5
  Top 0.305: U1.35 A11.1
N$6
  Top 0.305: IC1.6 13.09,11.4 R1.1 C5.1 R6.2
N$7
  Top 0.305: R5.2 C4.1 R2.1 13.09,14 IC1.2
N$8
  Top 0.305: IC3.2 61.41,12.67 R13.2 R11.2 | R11.2 R12.2 C7.1 | R11.2 R8.1
N$9
  Top 0.305: R16.1 C4.2 R2.2 14.14,14.65 IC1.1
N$10
  Top 0.305: IC1.7 14.14,10.75 R1.2 C5.2 R14.1
N$11
  Top 0.305: AOUTL.1 1.27,13.97 10.16,22.86 15.66,22.86 R17.2
N$12
  Top 0.305: AOUTR.1 9.58,5.08 10.99,3.67 16.79,3.67 R18.2
N$13
  Top 0.305: CV7B.1 64.77,6.35 R12.1
N$14
  Top 0.305: CV7.1 64.77,8.89 R11.1
N$15
  Top 0.305: IC1.13 25.01,14 R9.1 C9.1 R4.2
N$16
  Top 0.305: R62.2 R63.2 C10.1 | R62.2 R29.2 61.41,15.27 IC3.6 | R62.2 R15.1
N$17
  Top 0.305: R3.2 C8.1 R10.1 25.01,11.4 IC1.9
N$18
  Top 0.305: CV6.1 64.77,19.05 R62.1
N$19
  Top 0.305: CV6B.1 64.77,21.59 R63.1
N$20
  Top 0.305: AINL.1 2.54,11.43 2.54,13.97 10.16,21.59 12.7,21.59 13.55,20.74 R5.1
N$21
  Top 0.305: IC1.8 23.96,10.75 R10.2 C8.2 R18.1
N$22
  Top 0.305: CV3.1 64.77,26.67 R22.1
N$23
  Top 0.305: R17.1 C9.2 R9.2 23.96,14.65 IC1.14
N$24
  Top 0.305: IC4.2 61.41,32.99 R24.2 R23.2 | R23.2 R22.2 C16.1 | R23.2 R21.1
N$25
  Top 0.305: AINR.1 7.76,7.62 11.2,4.17 12.5,4.17 13.4,5.08 R6.1
N$26
  Top 0.305: CV2B.1 64.77,41.91 R28.1
N$27
  Top 0.305: CV3B.1 64.77,29.21 R23.1
N$28
  Top 0.305: 29.1 U1.36
N$29
  Top 0.305: C17.1 R28.2 R27.2 | R27.2 R26.2 61.41,35.59 IC4.6 | R27.2 R25.1
N$30
  Top 0.305: IC4.13 54.18,33.02 R37.2 R36.2 | R36.2 R35.2 52.49,27.94 C21.1 | R36.2 52.49,30.48 R34.1
N$31
  Top 0.305: R35.1 50.1,27.94 52.27,25.76 65,25.76 67.17,27.94 CV4.1
N$32
  Top 0.305: CV4B.1 65.35,25.4 65.21,25.26 51.08,25.26 49.09,27.24 49.09,28.64 49.95,29.49 R36.1
N$33
  Top 0.305: U1.37 30.1
N$34
  Top 0.305: CV1B.1 65.35,43.18 65.21,43.32 51.08,43.32 49.09,41.34 49.09,39.94 49.95,39.09 R32.1
N$35
  Top 0.305: R31.1 50.1,40.64 52.27,42.82 65,42.82 67.17,40.64 CV1.1
N$36
  Top 0.305: C20.1 52.49,40.64 R31.2 R32.2 | R30.1 52.49,38.1 R32.2 | R32.2 R33.2 51.68,35.59 IC4.9
N$37
  Top 0.305: U1.1 19.18,93.98 0.1
N$38
  Top 0.305: U1.2 18.99,91.38 18.92,91.44 1.1
N$39
  Top 0.305: U1.3 19.18,88.9 2.1
N$40
  Top 0.305: U1.4 18.99,86.3 18.92,86.36 3.1
N$41
  Top 0.305: R115.2 U1.12 6.35,58.42 11_SCL.1
N$42
  Top 0.305: U1.5 19.18,83.82 4.1
N$43
  Top 0.305: U1.6 18.99,81.22 18.92,81.28 5.1
N$44
  Top 0.305: U1.7 19.18,78.74 6.1
N$48
  Top 0.305: IC2.18 6.77,45.72 R19.2
N$51
  Top 0.305: L1.2 21.59,106.31 IC7.1 20.95,102.55 C28.2
N$52
  Top 0.305: 12_SDA.1 6.35,55.88 U1.13 R116.1
N$54
  Top 0.305: IC2.8 13.65,41.91 11.11,39.37 11.11,32.7 10.16,31.75 5.08,31.75 GPB7.1
N$55
  Top 0.305: IC2.7 13.1,40.64 11.62,39.16 11.62,32.49 10.37,31.24 4.87,31.24 3.09,33.02 GPB6.1
N$56
  Top 0.305: IC2.6 13.72,39.37 12.13,37.78 12.13,32.28 10.33,30.48 GPB5.1
N$57
  Top 0.305: IC3.13 51.68,12.67 R71.2 R69.2 | R69.2 R70.2 52.49,7.62 C14.1 | R69.2 52.49,10.16 R68.1
N$58
  Top 0.305: IC2.5 14.29,38.1 12.64,36.45 12.64,32.07 8.51,27.94 GPB4.1
N$59
  Top 0.305: IC2.4 14.41,36.83 13.14,35.56 13.14,31.86 6.68,25.4 GPB3.1
N$60
  Top 0.305: CV8.1 65.35,5.08 65.21,4.94 51.08,4.94 49.09,6.92 49.09,8.32 49.95,9.17 R69.1
N$61
  Top 0.305: IC2.3 15.24,35.56 13.65,33.97 13.65,31.65 4.86,22.86 GPB2.1
N$62
  Top 0.305: IC2.2 17.01,34.29 5.07,22.35 3.3,22.35 GPB1.1
N$63
  Top 0.305: IC2.1 16.51,33.02 GPB0.1
N$64
  Top 0.305: IC2.28 6.35,33.02 GPA7.1
N$65
  Top 0.305: IC2.27 7.62,34.29 GPA6.1
N$66
  Top 0.305: IC2.26 8.17,35.56 2.54,41.19 2.54,41.91 GPA5.1
N$67
  Top 0.305: IC2.25 7.62,36.83 3.05,41.4 3.05,44.45 1.78,45.72 GPA4.1
N$68
  Top 0.305: R70.1 50.1,7.62 52.27,5.44 65,5.44 67.17,7.62 CV8B.1
N$69
  Top 0.305: R66.1 50.1,20.32 52.27,22.5 65,22.5 67.17,20.32 CV5B.1
N$70
  Top 0.305: CV5.1 65.35,22.86 65.21,23 51.08,23 49.09,21.02 49.09,19.62 49.95,18.77 R65.1
N$71
  Top 0.305: R65.2 R66.2 52.49,20.32 C11.1 | R65.2 R67.2 51.68,15.27 IC3.9 | R65.2 52.49,17.78 R64.1
N$72
  Top 0.305: IC9.3 12.62,102.55 C29.2 L2.2
N$73
  Top 0.305: IC2.24 7.62,38.1 3.56,42.16 3.56,45.97 GPA3.1
N$74
  Top 0.305: IC2.23 7.62,39.37 4.06,42.93 4.06,48.01 GPA2.1
N$75
  Top 0.305: IC2.22 7.62,40.64 4.57,43.69 4.57,49.53 4.57,50.04 GPA1.1
N$76
  Top 0.305: IC2.21 7.62,41.91 5.08,44.45 5.08,52.07 GPA0.1
PE  (via drill 0.35)
  Top 0.305: GND4.1 42.55,101.6 C2.+ 40.32,101.92 C1.- 34.92,101.6 C3.- | C28.1 C27.1 | IC7.2 18.1,99.38 C28.1 | C28.1 C29.1 13.65,100.33 C30.- 8.89,102.14 IC9.2 IC9.2-2 | C18.1 63.49,35.15 61.95,35.15 61.75,34.94 IC4.5 58.45,34.94 v57.15,33.64 | v57.15,33.64 IC4.12 IC4.11 IC4.10 | IC4.3 v57.15,33.64 | IC3.3 v57.15,13.32 | v57.15,13.32 IC3.12 IC3.11 IC3.10 | C15.1 63.49,14.83 61.95,14.83 61.75,14.62 IC3.5 58.45,14.62 v57.15,13.32 | v56.52,46.67 56.62,46.57 C6.1 57.88,46.67 IC8.1 | 19.05,13.35 IC1.12 | IC1.5 19.05,12.05 | 19.05,12.05 IC1.10 | 19.05,12.05 v19.05,12.7 19.05,13.35 | C25.2 28.16,13.34 v28.89,13.34 | C26.1 11.21,13.34 v10.16,13.34 | IC2.15 IC2.16 IC2.17 v11.43,46.99 | IC2.10 v16.51,44.45 | 19.05,13.35 18.43,13.97 17.46,13.97 16.83,13.34 16.13,13.34 IC1.3 | GND7.1 55.88,96.52 GND3.1
  pour Bottom: 0,110.49 69.85,110.49 69.85,0 0,0
SPI_CS
  Top 0.305: U1.8 22.48,64.52 15.92,64.52 14.9,63.5 CS.1 13.08,63.5 11.91,64.67 10.26,64.67 7_CS.1
SPI_MISO  (via drill 0.35)
  Top 0.305: U1.10 16.51,63.5 MISO.1 13.08,60.96 11.91,62.13 7.72,62.13 9_MISO.1 | IC2.14 v21.59,49.53
  Bottom 0.305: v21.59,49.53 21.59,62.23 22.86,63.5 U1.10
SPI_MOSI  (via drill 0.35)
  Top 0.305: U1.11 15.62,60.96 14.45,59.79 13.49,59.79 12.32,60.96 MOSI.1 6.35,60.96 10_MOSI.1 | IC2.13 v22.86,48.26
  Bottom 0.305: v22.86,48.26 22.86,59.69 24.13,60.96 U1.11
SPI_SCK  (via drill 0.35)
  Top 0.305: U1.9 24.77,64.01 16.13,64.01 14.45,62.33 13.49,62.33 12.32,63.5 SCK.1 8.89,63.5 8_SCK.1 | IC2.12 v20.32,46.99
  Bottom 0.305: v20.32,46.99 20.32,63.5 22.86,66.04 U1.9

### Text on the board
tNames: 12V | 5V | 3.3VA | 3.3V | GND | 3.3V REG | -5V | -12V | GND | Rob Ellis 2023 | ANALOG IN | Daisy Motherboard v4
bNames: 12V | GND | -12V